# Altium project 1Rv2.PrjPCB (part 2 of 2)

## Sheet RF_ADF.SchDoc
size 320 x 228 mm; DocumentNumber: 5; SheetNumber: 5; SheetTotal: 5
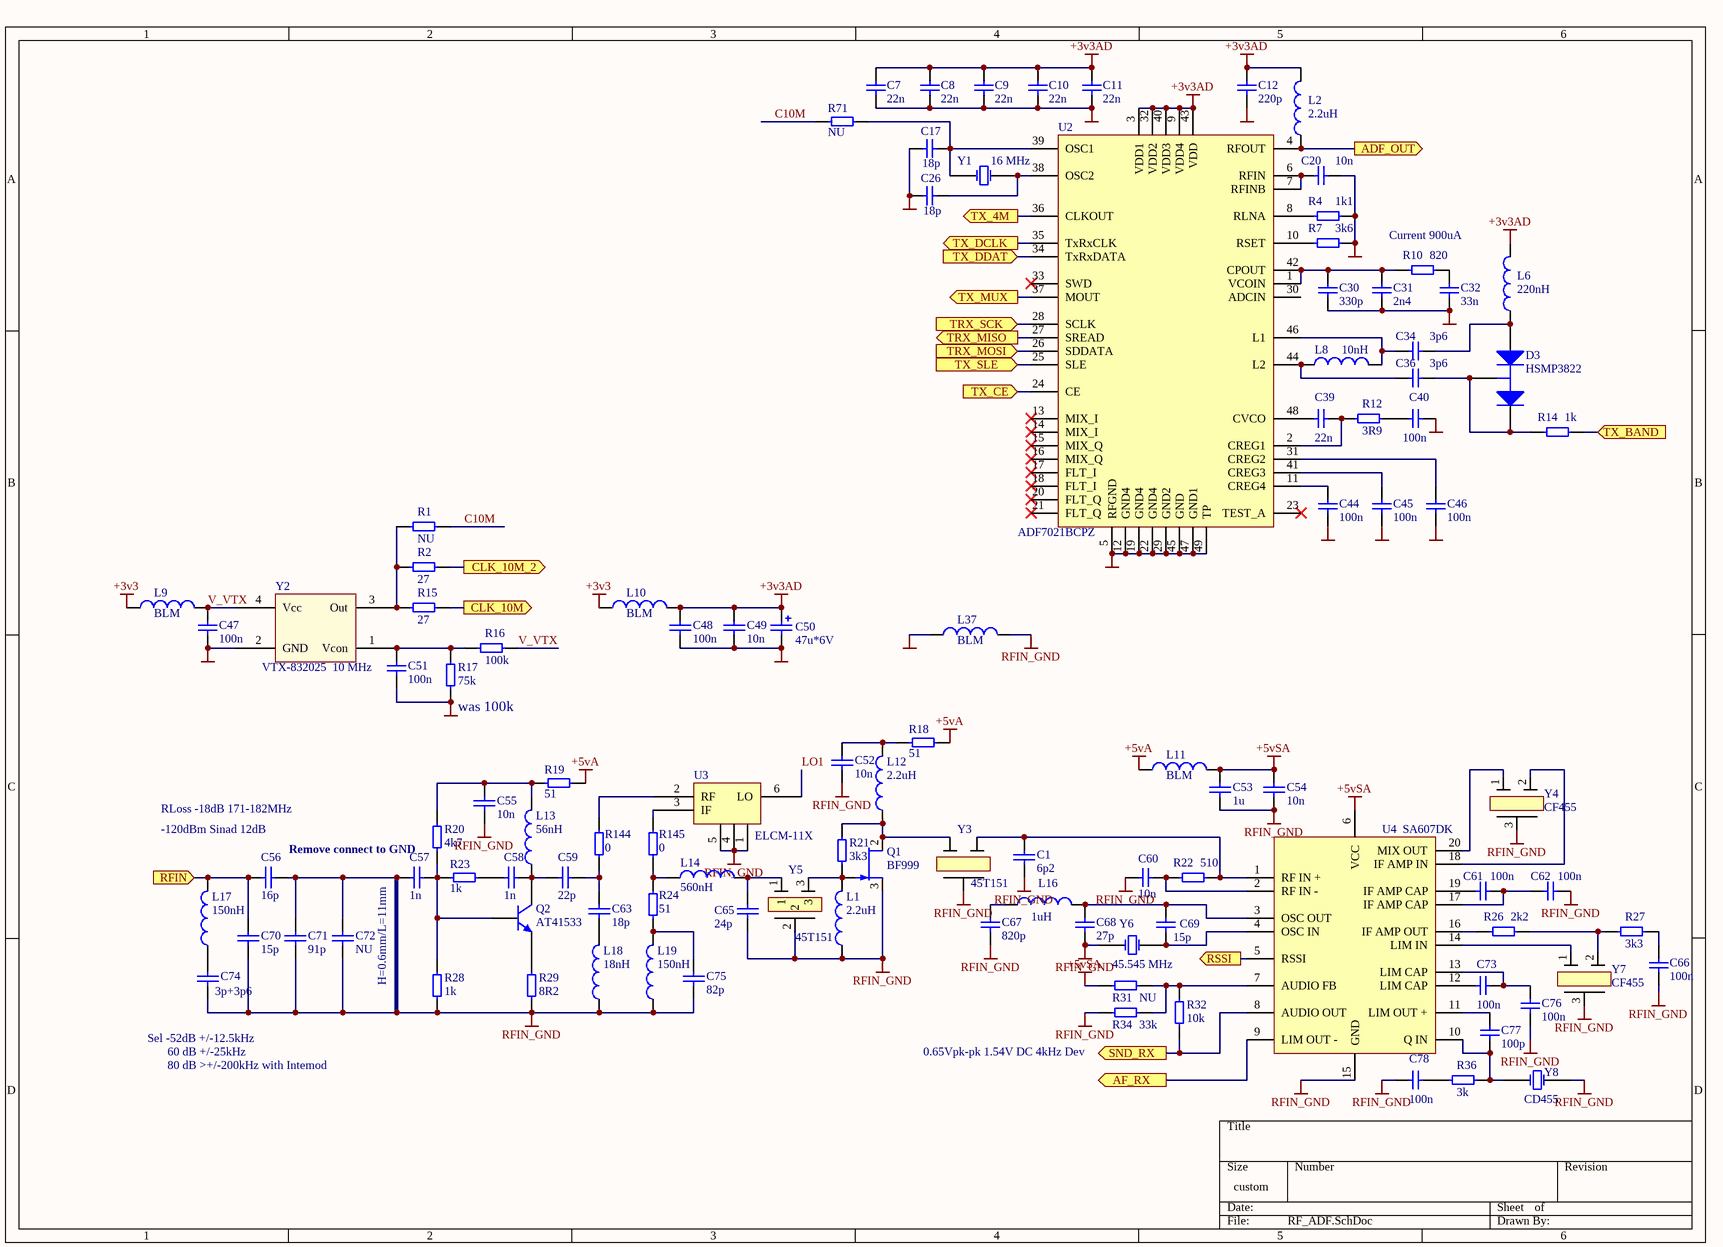
[diagram p4: RF_ADF.SchDoc]

### Parts
C1  6p2  [CAPC2012N]
C7  22n  [CAPC1608L]
C8  22n  [CAPC1608L]
C9  22n  [CAPC1608L]
C10  22n  [CAPC1608L]
C11  22n  [CAPC1608L]
C12  220p  [CAPC1608L]
C17  18p  [CAPC1608L]
C20  10n  [CAPC1608L]
C26  18p  [CAPC1608L]
C30  330p  [CAPC1608L]
C31  2n4  [CAPC1608L]
C32  33n  [CAPC1608L]
C34  3p6  [CAPC1608L]
C36  3p6  [CAPC1608L]
C39  22n  [CAPC1608L]
C40  100n  [CAPC1608L]
C44  100n  [CAPC1608L]
C45  100n  [CAPC1608L]
C46  100n  [CAPC1608L]
C47  100n  [CAPC1608L]
C48  100n  [CAPC1608N]
C49  10n  [CAPC1608N]
C50  47u*6V  [Case_A]
C51  100n  [CAPC1608L]
C52  10n  [CAPC2012N]
C53  1u  [CAPC2012L]
C54  10n  [CAPC1608L]
C55  10n  [CAPC2012N]
C56  16p  [CAPC2012N]
C57  1n  [CAPC2012N]
C58  1n  [CAPC2012N]
C59  22p  [CAPC2012N]
C60  10n  [CAPC1608L]
C61  100n  [CAPC1608L]
C62  100n  [CAPC1608L]
C63  18p  [CAPC2012N]
C65  24p  [CAPC2012N]
C66  100n  [CAPC1608L]
C67  820p  [CAPC1608L]
C68  27p  [CAPC1608L]
C69  15p  [CAPC1608L]
C70  15p  [CAPC2012N]
C71  91p  [CAPC2012N]
C72  NU  [CAPC2012N]
C73  100n  [CAPC1608L]
C74  3p+3p6  [CAPC2012N]
C75  82p  [CAPC2012N]
C76  100n  [CAPC1608L]
C77  100p  [CAPC1608L]
C78  100n  [CAPC1608L]
D3  HSMP3822  [SOT-23]
L1  2.2uH  [INDC2012N]
L2  2.2uH  [INDC2012L]
L6  220nH  [INDC2012L]
L8  10nH  [INDC2012L]
L9  BLM  [CAPC2012N]
L10  BLM  [CAPC2012N]
L11  BLM  [CAPC2012N]
L12  2.2uH  [INDC2012N]
L13  56nH  [INDC2012N]
L14  560nH  [INDC2012N]
L16  1uH  [INDC2012L]
L17  150nH  [INDC2012N]
L18  18nH  [INDC2012N]
L19  150nH  [INDC2012N]
L37  BLM  [CAPC2012N]
Q1  BF999  [sot23_n]
Q2  AT41533  [SOT-23]
R1  NU  [RESC1608L]
R2  27  [RESC1608L]
R4  1k1  [RESC1608L]
R7  3k6  [RESC1608L]
R10  820  [RESC1608L]
R12  3R9  [RESC1608L]
R14  1k  [RESC1608L]
R15  27  [RESC1608L]
R16  100k  [RESC1608L]
R17  75k  [RESC1608L]
R18  51  [RESC2012N]
R19  51  [RESC2012N]
R20  4k7  [RESC2012N]
R21  3k3  [RESC2012N]
R22  510  [RESC1608L]
R23  1k  [RESC2012N]
R24  51  [RESC2012N]
R26  2k2  [RESC1608L]
R27  3k3  [RESC1608L]
R28  1k  [RESC2012N]
R29  8R2  [RESC2012N]
R31  NU  [RESC1608L]
R32  10k  [RESC1608L]
R34  33k  [RESC1608L]
R36  3k  [RESC1608L]
R71  NU  [RESC1608L]
R144  0  [RESC1608L]
R145  0  [RESC1608L]
U2  ADF7021BCPZ  [QFN50P700X700X100-49N]
U3  ELCM-11X  [ELCM-11X]
U4  SA607DK  [SOT266-1]
Y1  16 MHz  [NX3225A]
Y2  VTX-832025  10 MHz  [SMD3.2x5]
Y3  45T151  [45T151AF]
Y4  CF455  [CFUCG455G]
Y5  45T151  [45T151AF]
Y6  45.545 MHz  [SIWARD UM-58]
Y7  CF455  [CFUCG455G]
Y8  CD455  [CDBC455CLX1]

### Ports
ADF_OUT (out), AF_RX (out), CLK_10M (out), CLK_10M_2 (out), RFIN (in), RSSI (out), SND_RX (out), TRX_MISO (out), TRX_MOSI (in), TRX_SCK (in), TX_4M (out), TX_BAND (in), TX_CE (in), TX_DCLK (out), TX_DDAT (in), TX_MUX (out), TX_SLE (in)

### Nets
+3v3: L9.1 L10.1
+3v3AD: C7.1 C8.1 C9.1 C10.1 C11.1 C12.1 C48.2 C49.2 C50.1 L2.2 L6.2 L10.2 U2.3(VDD1) U2.9(VDD4) U2.32(VDD2) U2.40(VDD3) U2.43(VDD)
+5vA: L11.1 R18.2 R19.2
+5vSA: C53.2 C54.2 L11.2 R31.2 U4.6(VCC)
GND: C7.2 C8.2 C9.2 C10.2 C11.2 C12.2 C17.1 C20.1 C26.2 C30.2 C31.2 C32.2 C40.1 C44.2 C45.2 C46.2 C47.2 C48.1 C49.1 C50.2 C51.2 L37.1 R4.1 R7.1 R17.2 U2.5(RFGND) U2.12(GND4) U2.19(GND4) U2.22(GND4) U2.29(GND2) U2.45(GND) U2.47(GND1) U2.49(TP) Y2.2(GND)
RFIN_GND: C1.1 C52.1 C53.1 C54.1 C55.1 C56.1 C57.2 C60.1 C62.2 C65.1 C66.2 C67.1 C68.1 C70.1 C71.1 C71.2 C72.1 C72.2 C74.1 C75.1 C76.1 C78.1 L1.1 L18.1 L19.1 L37.2 Q1.3(S) R28.2 R29.2 R34.1 U3.1(GND) U3.4(GND) U3.5(GND) U4.15(GND) Y3.2 Y4.3(GND) Y5.2 Y6.2(OSC2) Y7.3 Y8.2(OSC2)
ADF_OUT: L2.1 U2.4(RFOUT) ; port ADF_OUT
AF_RX: U4.9(LIM_OUT_-) ; port AF_RX
C10M: R1.1 R71.1
CLK_10M: R15.1 ; port CLK_10M
CLK_10M_2: R2.1 ; port CLK_10M_2
LO1: U3.6(LO)
RFIN: C56.2 C70.2 L17.2 ; port RFIN
RSSI: U4.5(RSSI) ; port RSSI
SND_RX: R32.2 U4.8(AUDIO_OUT) ; port SND_RX
TRX_MISO: U2.27(SREAD) ; port TRX_MISO
TRX_MOSI: U2.26(SDDATA) ; port TRX_MOSI
TRX_SCK: U2.28(SCLK) ; port TRX_SCK
TX_4M: U2.36(CLKOUT) ; port TX_4M
TX_BAND: R14.1 ; port TX_BAND
TX_CE: U2.24(CE) ; port TX_CE
TX_DCLK: U2.35(TxRxCLK) ; port TX_DCLK
TX_DDAT: U2.34(TxRxDATA) ; port TX_DDAT
TX_MUX: U2.37(MOUT) ; port TX_MUX
TX_SLE: U2.25(SLE) ; port TX_SLE
V_VTX: C47.1 L9.2 R16.1 Y2.4(Vcc)
NetC1_2: C1.2 R22.1 U4.1(RF_IN_+) Y3.3
NetC17_2: C17.2 R71.2 U2.39(OSC1) Y1.1(OSC1)
NetC20_2: C20.2 U2.6(RFIN) U2.7(RFINB)
NetC26_1: C26.1 U2.38(OSC2) Y1.2(OSC2)
NetC30_1: C30.1 C31.1 R10.2 U2.1(VCOIN) U2.42(CPOUT)
NetC32_1: C32.1 R10.1
NetC34_1: C34.1 D3.1(A) L6.1
NetC34_2: C34.2 L8.2 U2.46(L1)
NetC36_1: C36.1 D3.2(K) D3.3(C) R14.2
NetC36_2: C36.2 L8.1 U2.44(L2)
NetC39_1: C39.1 R12.2 U2.2(CREG1)
NetC39_2: C39.2 U2.48(CVCO)
NetC40_2: C40.2 R12.1
NetC44_1: C44.1 U2.11(CREG4)
NetC45_1: C45.1 U2.41(CREG3)
NetC46_1: C46.1 U2.31(CREG2)
NetC51_1: C51.1 R16.2 R17.1 Y2.1(Vcon)
NetC52_2: C52.2 L12.2 R18.1
NetC55_2: C55.2 L13.2 R19.1 R20.1
NetC57_1: C57.1 Q2.1(B) R20.2 R23.1 R28.1
NetC58_1: C58.1 C59.2 L13.1 Q2.3(C)
NetC58_2: C58.2 R23.2
NetC59_1: C59.1 C63.2 R144.2
NetC60_2: C60.2 R22.2 U4.2(RF_IN_-)
NetC61_1: C61.1 U4.19(IF_AMP_CAP)
NetC61_2: C61.2 C62.1 U4.17(IF_AMP_CAP)
NetC63_1: C63.1 L18.2
NetC65_2: C65.2 L14.2 Y5.1
NetC66_1: C66.1 R27.1
NetC67_2: C67.2 L16.1
NetC68_2: C68.2 C69.2 L16.2 U4.3(OSC_OUT)
NetC69_1: C69.1 U4.4(OSC_IN) Y6.1(OSC1)
NetC73_1: C73.1 U4.12(LIM_CAP)
NetC73_2: C73.2 C76.2 U4.13(LIM_CAP)
NetC74_2: C74.2 L17.1
NetC75_2: C75.2 L19.2 R24.2
NetC77_1: C77.1 R36.1 U4.10(Q_IN) Y8.1(OSC1)
NetC77_2: C77.2 U4.11(LIM_OUT_+)
NetC78_2: C78.2 R36.2
NetL1_2: L1.2 Q1.1(G) R21.2 Y5.3
NetL12_1: L12.1 Q1.2(D) R21.1 Y3.1
NetL14_1: L14.1 R24.1 R145.2
NetQ2_2: Q2.2(E) R29.1
NetR1_2: R1.2 R2.2 R15.2 Y2.3(Out)
NetR4_2: R4.2 U2.8(RLNA)
NetR7_2: R7.2 U2.10(RSET)
NetR26_1: R26.1 R27.2 Y7.2
NetR26_2: R26.2 U4.16(IF_AMP_OUT)
NetR31_1: R31.1 R32.1 R34.2 U4.7(AUDIO_FB)
NetR144_1: R144.1 U3.2(RF)
NetR145_1: R145.1 U3.3(IF)
NetU4_14: U4.14(LIM_IN) Y7.1
NetU4_18: U4.18(IF_AMP_IN) Y4.2(Out)
NetU4_20: U4.20(MIX_OUT) Y4.1(In)

Not connected (* = marked no-connect by the designer): U2 13(MIX_I)* 14(MIX_I)* 15(MIX_Q)* 16(MIX_Q)* 17(FLT_I)* 18(FLT_I)* 20(FLT_Q)* 21(FLT_Q)* 23(TEST_A)* 30(ADCIN) 33(SWD)*

### Notes on the sheet
- Current 900uA
- (near R17) was 100k
- -120dBm Sinad 12dB
- RLoss -18dB 171-182MHz
- Remove connect to GND
- H=0.6mm/L=11mm
- (near C74) Sel -52dB +/-12.5kHz
- 60 dB +/-25kHz
- (near R34) 0.65Vpk-pk 1.54V DC 4kHz Dev
- 80 dB >+/-200kHz with Intemod

### Library data of the parts
C1 C7-C12 C17 C20 C26 C30-C32 C34 C36 C39 C40 C44-C49 C51-C63 C65-C78 = Cap: Capacitor; Value: 100pF; Published: 8-Jun-2000; LatestRevisionDate: 17-Jul-2002; LatestRevisionNote: Re-released for DXP Platform.; PackageReference: RAD-0.3; Publisher: Altium Limited
C50 = Cap Pol: Polarized Capacitor (Surface Mount); Value: 100pF; Published: 8-Jun-2000; LatestRevisionDate: 17-Jul-2002; LatestRevisionNote: Re-released for DXP Platform.; PackageReference: C0805; Publisher: Altium Limited
D3 = SMBD7000: Silicon Switching Diode Array for High-Speed Switching; Type: Диод; Published: 21-Mar-2003; DatasheetDocument: Oct-1999; PackageDocument: Sep-2001; PackageReference: SOT-23; Publisher: Altium Limited; ComponentLink1Description: Manufacturer Link; ComponentLink1URL: http://www.infineon.com/
L1 L12-L14 L17-L19 = Inductor: Code_IEC: 1005; Value: 10mH; Published: 8-Jun-2000; LatestRevisionDate: 17-Jul-2002; LatestRevisionNote: Re-released for DXP Platform.; PackageReference: 0402-A; Publisher: Altium Limited; Code_JEITA: 0402
L2 L6 L8 L16 = INDUCTOR: Type: Индуктивность
L9-L11 L37 = Ferrite Bead: Code_IEC: 1005; Value: 10mH; Published: 8-Jun-2000; LatestRevisionDate: 17-Jul-2002; LatestRevisionNote: Re-released for DXP Platform.; PackageReference: 0402-A; Publisher: Altium Limited; Code_JEITA: 0402
Q1 = BF999: N-channel Silicon Junction Field-effect Transistor; Published: 17-Sep-2003; LatestRevisionDate: 12-Dec-2006; LatestRevisionNote: IPC-7351 Footprint Added.; DatasheetVersion: 29-Jul-1996; PackageVersion: May-1999; PackageReference: SOT23; Publisher: Altium Limited; PackageDescription: 3-Pin SOT-23 Package 0.95 mm Pitch, 2.3 mm Lead Span; ComponentLink1Description: Manufacturer Link; ComponentLink1URL: http://www.semiconductors.philips.com/; ComponentLink2Description: Datasheet; ComponentLink2URL: http://www.semiconductors.philips.com/acrobat/datasheets/BF545A_BF545B_BF545C_3.pdf
Q2 = BFR92A: NPN 5 GHz Wideband Transistor; Published: 17-Sep-2003; LatestRevisionDate: 12-Dec-2006; LatestRevisionNote: IPC-7351 Footprint Added.; DatasheetVersion: 29-Oct-1997; PackageVersion: May-1999; PackageReference: SOT23; Publisher: Altium Limited; PackageDescription: 3-Pin SOT-23 Package 0.95 mm Pitch, 2.3 mm Lead Span; ComponentLink1Description: Manufacturer Link; ComponentLink1URL: http://www.semiconductors.philips.com/; ComponentLink2Description: Datasheet; ComponentLink2URL: http://www.semiconductors.philips.com/acrobat/datasheets/BFR92A_2.pdf
R1 R2 R4 R7 R10 R12 R15-R22 R24 R26 R27 R29 R31 R32 R34 R36 R71 R144 R145 = Res: Resistor; Value: 1K; Published: 8-Jun-2000; LatestRevisionDate: 04-Mar-2005; LatestRevisionNote: PCB Footprint replaced.; PackageReference: J1-0603; Publisher: Altium Limited
R14 R23 R28 = Res: Resistor; Published: 8-Jun-2000; LatestRevisionDate: 04-Mar-2005; LatestRevisionNote: PCB Footprint replaced.; PackageReference: J1-0603; Publisher: Altium Limited; Value: 1K
U2 = ADF7021: ISM Band, FSK/ASK Tranceiver IC
U3 = ELCM-11X: Broadband mixer
U4 = SA607: Low-voltage high perfomance mixer FM IF system
Y1 Y6 = XTAL: Crystal Oscillator; Published: 8-Jun-2000; LatestRevisionDate: 17-Jul-2002; LatestRevisionNote: Re-released for DXP Platform.; PackageReference: R38; Publisher: Altium Limited
Y2 = KT18B-DCU28B
Y3 Y5 = SFE10.7MS3: 10.7 IF Filter
Y4 Y7 = SFE10.7MS3: 455k IF Filter
Y8 = XTAL: 455k Discriminator; Published: 8-Jun-2000; LatestRevisionDate: 17-Jul-2002; LatestRevisionNote: Re-released for DXP Platform.; PackageReference: R38; Publisher: Altium Limited

## Sheet RF_VCO.SchDoc
size A4
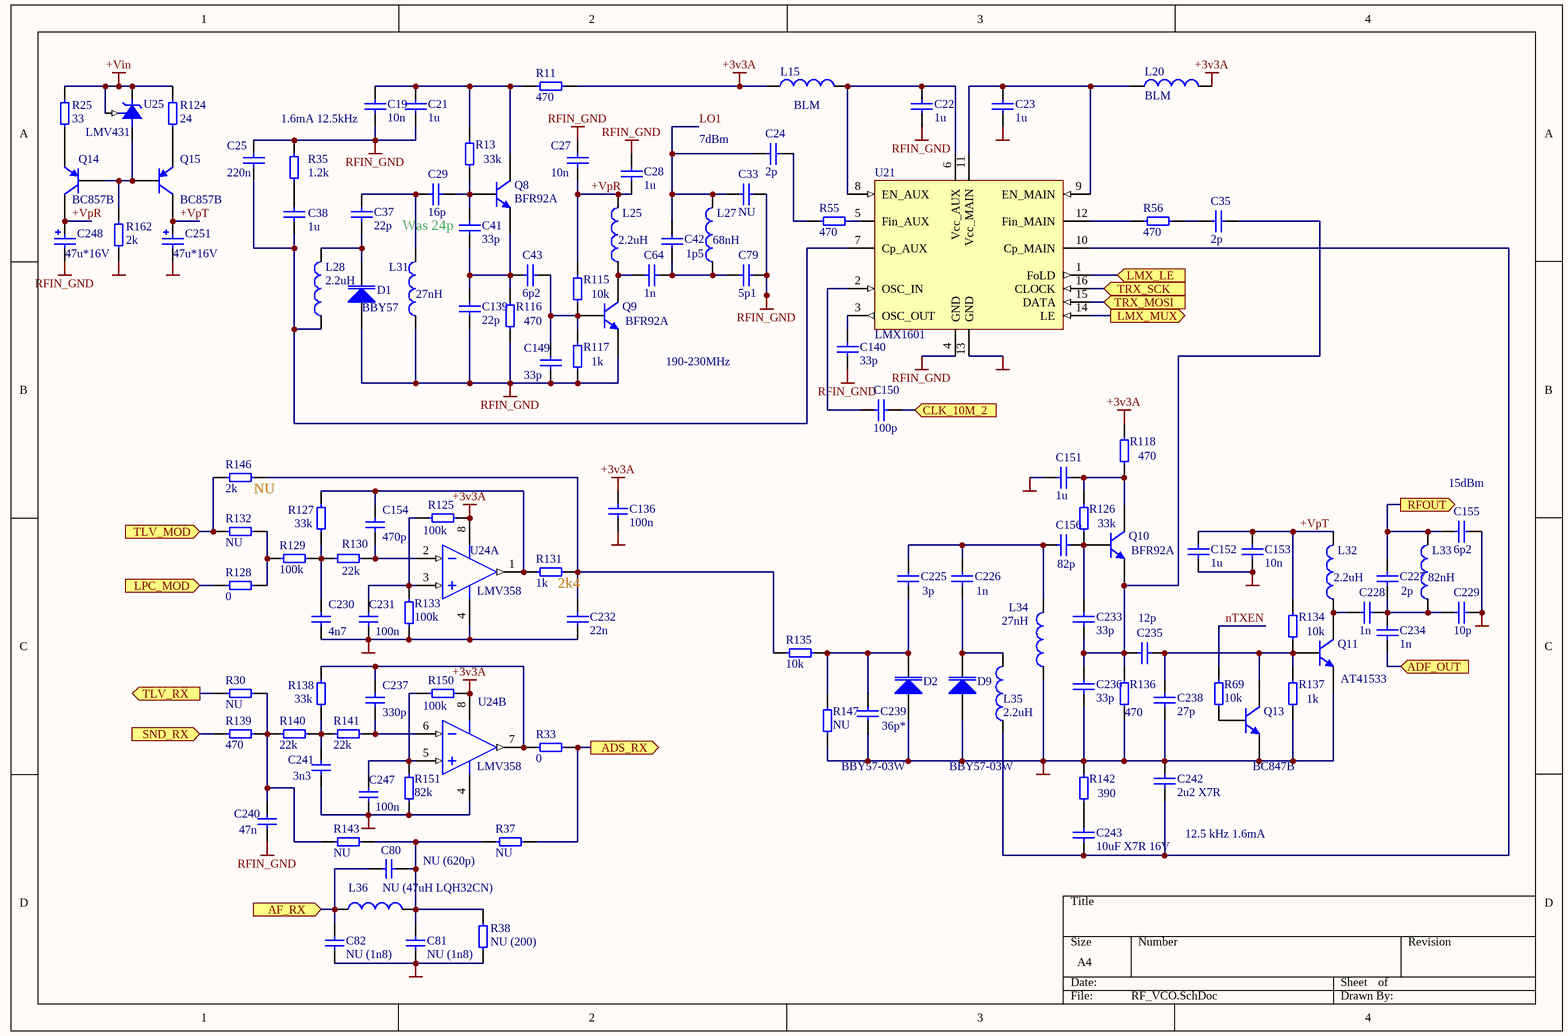
[diagram p5: RF_VCO.SchDoc]

### Parts
C19  10n  [CAPC1608L]
C21  1u  [CAPC2012L]
C22  1u  [CAPC2012L]
C23  1u  [CAPC2012L]
C24  2p  [CAPC1608L]
C25  220n  [CAPC1608L]
C27  10n  [CAPC1608L]
C28  1u  [CAPC2012L]
C29  16p  [CAPC1608L]
C33  NU  [CAPC1608L]
C35  2p  [CAPC1608L]
C37  22p  [CAPC1608L]
C38  1u  [CAPC2012L]
C41  33p  [CAPC1608L]
C42  1p5  [CAPC1608L]
C43  6p2  [CAPC1608L]
C64  1n  [CAPC1608L]
C79  5p1  [CAPC1608L]
C80  NU (620p)  [CAPC1608L]
C81  NU (1n8)  [CAPC1608L]
C82  NU (1n8)  [CAPC1608L]
C136  100n  [CAPC1608L]
C139  22p  [CAPC1608L]
C140  33p  [CAPC1608L]
C149  33p  [CAPC1608L]
C150  100p  [CAPC1608L]
C151  1u  [CAPC2012L]
C152  1u  [CAPC2012L]
C153  10n  [CAPC1608L]
C154  470p  [CAPC1608L]
C155  6p2  [CAPC1608L]
C156  82p  [CAPC1608L]
C225  3p  [CAPC1608L]
C226  1n  [CAPC1608L]
C227  2p  [CAPC1608L]
C228  1n  [CAPC1608L]
C229  10p  [CAPC1608L]
C230  4n7  [CAPC1608L]
C231  100n  [CAPC1608L]
C232  22n  [CAPC1608L]
C233  33p  [CAPC1608L]
C234  1n  [CAPC1608L]
C235  12p  [CAPC1608L]
C236  33p  [CAPC1608L]
C237  330p  [CAPC1608L]
C238  27p  [CAPC1608L]
C239  36p*  [CAPC1608L]
C240  47n  [CAPC1608L]
C241  3n3  [CAPC1608L]
C242  2u2 X7R  [CAPC2012L]
C243  10uF X7R 16V  [CAPC3216M]
C247  100n  [CAPC1608L]
C248  47u*16V  [Case_C]
C251  47u*16V  [Case_C]
D1  BBY57  [SOD-323]
D2  BBY57-03W  [SOD-323]
D9  BBY57-03W  [SOD-323]
L15  BLM  [CAPC2012N]
L20  BLM  [CAPC2012N]
L25  2.2uH  [INDC2012L]
L27  68nH  [INDC2012L]
L28  2.2uH  [INDC2012L]
L31  27nH  [INDC2012L]
L32  2.2uH  [INDC2012L]
L33  82nH  [INDC2012L]
L34  27nH  [INDC2012L]
L35  2.2uH  [INDC2012L]
L36  NU (47uH LQH32CN)  [CAPC3225N]
Q8  BFR92A  [SOT-23]
Q9  BFR92A  [SOT-23]
Q10  BFR92A  [SOT-23]
Q11  AT41533  [SOT-23]
Q13  BC847B  [SOT23_N]
Q14  BC857B  [SOT23_N]
Q15  BC857B  [SOT23_N]
R11  470  [RESC1608L]
R13  33k  [RESC1608L]
R25  33  [RESC1608L]
R30  NU  [RESC1608L]
R33  0  [RESC1608L]
R35  1.2k  [RESC1608L]
R37  NU  [RESC1608L]
R38  NU (200)  [RESC1608L]
R55  470  [RESC1608L]
R56  470  [RESC1608L]
R69  10k  [RESC1608L]
R115  10k  [RESC1608L]
R116  470  [RESC1608L]
R117  1k  [RESC1608L]
R118  470  [RESC1608L]
R124  24  [RESC1608L]
R125  100k  [RESC1608L]
R126  33k  [RESC1608L]
R127  33k  [RESC1608L]
R128  0  [RESC1608L]
R129  100k  [RESC1608L]
R130  22k  [RESC1608L]
R131  1k  [RESC1608L]
R132  NU  [RESC1608L]
R133  100k  [RESC1608L]
R134  10k  [RESC1608L]
R135  10k  [RESC1608L]
R136  470  [RESC1608L]
R137  1k  [RESC1608L]
R138  33k  [RESC1608L]
R139  470  [RESC1608L]
R140  22k  [RESC1608L]
R141  22k  [RESC1608L]
R142  390  [RESC1608L]
R143  NU  [RESC1608L]
R146  2k  [RESC1608L]
R147  NU  [RESC1608L]
R150  100k  [RESC1608L]
R151  82k  [RESC1608L]
R162  2k  [RESC1608L]
U21  LMX1601  [TSSOP65P640X120-16N]
U24  LMV358  [SOIC-150-8]  (parts A,B of 2)
U25  LMV431  [MF03A_N]

### Ports
ADF_OUT (in), ADS_RX (out), AF_RX (in), CLK_10M_2 (in), LMX_LE (in), LMX_MUX (out), LPC_MOD (in), RFOUT (out), SND_RX (in), TLV_MOD (in), TLV_RX (out), TRX_MOSI (in), TRX_SCK (in)

### Nets
+3v3A: C136.1 L15.2 L20.2 R11.2 R118.1 R125.2 R150.2 U24.8(V+)
+Vin: R25.2 R124.2 U25.1(REF) U25.2(K)
GND: C23.1 C81.1 C82.1 C136.2 C151.2 C152.1 C153.1 C155.2 C229.2 C230.2 C231.2 C232.2 C236.2 C238.2 C239.1 C241.2 C242.1 C247.2 C251.2 D2.2(A) D9.2(A) L34.1 Q11.2(E) Q13.2(E) R38.2 R133.2 R136.2 R137.2 R142.1 R147.1 R151.2 R162.1 U21.13(GND) U24.4(V-)
RFIN_GND: C19.1 C21.1 C22.1 C25.1 C27.1 C28.1 C33.2 C79.2 C139.2 C140.2 C149.2 C240.2 C248.2 D1.2(A) L31.1 Q9.2(E) R35.1 R116.2 R117.2 U21.4(GND)
+VpR: C27.2 C28.2 C248.1 L25.2 Q14.3(C) R115.1
+VpT: C152.2 C153.2 C251.1 L32.2 Q15.3(C) R134.1
ADF_OUT: C234.2 ; port ADF_OUT
ADS_RX: R33.2 R37.1 ; port ADS_RX
AF_RX: C80.2 C82.2 L36.1 ; port AF_RX
CLK_10M_2: C150.2 ; port CLK_10M_2
LMX_LE: U21.1(FoLD) ; port LMX_LE
LMX_MUX: U21.14(LE) ; port LMX_MUX
LO1: C24.1 C33.1 C42.2 L27.2
LPC_MOD: R128.1 ; port LPC_MOD
nTXEN: R69.1
RFOUT: C155.1 C227.2 L33.2 ; port RFOUT
SND_RX: R139.2 ; port SND_RX
TLV_MOD: R132.1 R146.1 ; port TLV_MOD
TLV_RX: R30.2 ; port TLV_RX
TRX_MOSI: U21.15(DATA) ; port TRX_MOSI
TRX_SCK: U21.16(CLOCK) ; port TRX_SCK
NetC19_2: C19.2 C21.2 Q8.3(C) R11.1 R13.1
NetC22_2: C22.2 L15.1 U21.6(Vcc_AUX) U21.8(EN_AUX)
NetC23_2: C23.2 L20.1 U21.9(EN_MAIN) U21.11(Vcc_MAIN)
NetC24_2: C24.2 R55.1
NetC25_2: C25.2 C38.2 L28.1 U21.7(Cp_AUX)
NetC29_1: C29.1 C41.1 Q8.1(B) R13.2
NetC29_2: C29.2 C37.2 L31.2
NetC35_1: C35.1 R56.2
NetC35_2: C35.2 C233.2 C235.1 C236.1 Q10.2(E) R136.1
NetC37_1: C37.1 D1.1(K) L28.2
NetC38_1: C38.1 R35.2
NetC41_2: C41.2 C43.2 C139.1 Q8.2(E) R116.1
NetC42_1: C42.1 C64.1 C79.1 L27.1
NetC43_1: C43.1 C149.1 Q9.1(B) R115.2 R117.1
NetC64_2: C64.2 L25.1 Q9.3(C)
NetC80_1: C80.1 C81.2 L36.2 R37.2 R38.1 R143.2
NetC140_1: C140.1 U21.3(OSC_OUT)
NetC150_1: C150.1 U21.2(OSC_IN)
NetC151_1: C151.1 Q10.3(C) R118.2 R126.1
NetC154_1: C154.1 R127.1 R131.1 U24.1(OUTA)
NetC154_2: C154.2 R130.2 U24.2(INA-)
NetC156_1: C156.1 C233.1 Q10.1(B) R126.2
NetC156_2: C156.2 C225.2 C226.2 L34.2
NetC225_1: C225.1 C239.2 D2.1(K) R135.2 R147.2
NetC226_1: C226.1 D9.1(K) L35.2
NetC227_1: C227.1 C228.1 C229.1 C234.1 L33.1
NetC228_2: C228.2 L32.1 Q11.3(C)
NetC230_1: C230.1 R127.2 R129.2 R130.1
NetC231_1: C231.1 R125.1 R133.1 U24.3(INA+)
NetC232_1: C232.1 R131.2 R135.1 R146.2
NetC235_2: C235.2 C238.1 Q11.1(B) Q13.3(C) R134.2 R137.1
NetC237_1: C237.1 R33.1 R138.1 U24.7(OUTB)
NetC237_2: C237.2 R141.1 U24.6(INB-)
NetC240_1: C240.1 R30.1 R139.1 R140.2 R143.1
NetC241_1: C241.1 R138.2 R140.1 R141.2
NetC242_2: C242.2 C243.1 L35.1 U21.10(Cp_MAIN)
NetC243_2: C243.2 R142.2
NetC247_1: C247.1 R150.1 R151.1 U24.5(INB+)
NetQ13_1: Q13.1(B) R69.2
NetQ14_1: Q14.1(B) Q15.1(B) R162.2 U25.3(A)
NetQ14_2: Q14.2(E) R25.1
NetQ15_2: Q15.2(E) R124.1
NetR55_2: R55.2 U21.5(Fin_AUX)
NetR56_1: R56.1 U21.12(Fin_MAIN)
NetR128_2: R128.2 R129.1 R132.2

### Notes on the sheet
- 1.6mA 12.5kHz
- 7dBm
- Was 24p
- 190-230MHz
- (near R146) NU
- 15dBm
- (near R131) 2k4
- (near C242) 12.5 kHz 1.6mA

### Library data of the parts
C19 C21-C25 C27-C29 C33 C35 C37 C38 C41-C43 C64 C79-C82 C136 C139 C140 C149-C156 C225-C243 C247 = Cap: Capacitor; Value: 100pF; Published: 8-Jun-2000; LatestRevisionDate: 17-Jul-2002; LatestRevisionNote: Re-released for DXP Platform.; PackageReference: RAD-0.3; Publisher: Altium Limited
C248 C251 = Cap Pol: as C50 on sheet RF_ADF; Published: 8-Jun-2000; LatestRevisionDate: 17-Jul-2002; LatestRevisionNote: Re-released for DXP Platform.; PackageReference: C0805; Publisher: Altium Limited
D1 D2 D9 = BBY57-03W: Silicon High Q Hyperabrupt Tuning Diode; Published: 21-Mar-2003; LatestRevisionDate: 19-Mar-2004; LatestRevisionNote: Silkscreen size reduced.; DatasheetDocument: Aug-1998; PackageDocument: Sep-2000; PackageReference: SOD-323; Publisher: Altium Limited; ComponentLink1Description: Manufacturer Link; ComponentLink1URL: http://www.infineon.com/
L15 L20 = Ferrite Bead: Code_IEC: 1005; Value: 10mH; Published: 8-Jun-2000; LatestRevisionDate: 17-Jul-2002; LatestRevisionNote: Re-released for DXP Platform.; PackageReference: 0402-A; Publisher: Altium Limited; Code_JEITA: 0402
L25 L27 L28 L31-L36 = INDUCTOR
Q8-Q11 = BFR92A: NPN 5 GHz Wideband Transistor; Published: 17-Sep-2003; LatestRevisionDate: 12-Dec-2006; LatestRevisionNote: IPC-7351 Footprint Added.; DatasheetVersion: 29-Oct-1997; PackageVersion: May-1999; PackageReference: SOT23; Publisher: Altium Limited; PackageDescription: 3-Pin SOT-23 Package 0.95 mm Pitch, 2.3 mm Lead Span; ComponentLink1Description: Manufacturer Link; ComponentLink1URL: http://www.semiconductors.philips.com/; ComponentLink2Description: Datasheet; ComponentLink2URL: http://www.semiconductors.philips.com/acrobat/datasheets/BFR92A_2.pdf
Q13 = BC847B: NPN General-purpose Transistor; Published: 17-Sep-2003; LatestRevisionDate: 12-Dec-2006; LatestRevisionNote: IPC-7351 Footprint Added.; DatasheetVersion: 4-Feb-2002; PackageVersion: May-1999; PackageReference: SOT23; Publisher: Altium Limited; PackageDescription: 3-Pin SOT-23 Package 0.95 mm Pitch, 2.3 mm Lead Span; ComponentLink1Description: Manufacturer Link; ComponentLink1URL: http://www.semiconductors.philips.com/; ComponentLink2Description: Datasheet; ComponentLink2URL: http://www.semiconductors.philips.com/acrobat/datasheets/BC846_BC847_BC848_5.pdf
Q14 Q15 = BC857B: PNP General-purpose Transistor; Published: 17-Sep-2003; LatestRevisionDate: 12-Dec-2006; LatestRevisionNote: IPC-7351 Footprint Added.; DatasheetVersion: 4-Feb-2002; PackageVersion: May-1999; PackageReference: SOT23; Publisher: Altium Limited; PackageDescription: 3-Pin SOT-23 Package 0.95 mm Pitch, 2.3 mm Lead Span; ComponentLink1Description: Manufacturer Link; ComponentLink1URL: http://www.semiconductors.philips.com/; ComponentLink2Description: Datasheet; ComponentLink2URL: http://www.semiconductors.philips.com/acrobat/datasheets/BC856_BC857_BC858_6.pdf
R11 R13 R25 R30 R33 R35 R37 R38 R55 R56 R69 R115 R116 R118 R124-R130 R132-R136 R138-R143 R146 R147 R150 R151 R162 = Res: Resistor; Value: 1K; Published: 8-Jun-2000; LatestRevisionDate: 04-Mar-2005; LatestRevisionNote: PCB Footprint replaced.; PackageReference: J1-0603; Publisher: Altium Limited
R117 R131 R137 = Res: Resistor; Published: 8-Jun-2000; LatestRevisionDate: 04-Mar-2005; LatestRevisionNote: PCB Footprint replaced.; PackageReference: J1-0603; Publisher: Altium Limited; Value: 1K
U21 = LMX1601: Synthesizer
U24 = LMV358M: General Purpose, Low Voltage, Rail-to-Rail Output Operational Amplifiers; Manufacturer: National Semiconductor; PackageTopMarking: NSZXTT*LMV*358M; PowerWise: N; Published: 4-Dec-2008; LatestRevisionDate: 13-Jan-2009; LatestRevisionNote: Sim Model Added.; DatasheetVersion: Oct-2007; PackageVersion: revL, Sep-2006; PackageReference: M08A; Publisher: Altium Limited; PackageDescription: SOIC Narrow, 4.9 x 3.9 x 1.45mm, 8 Lead, 1.27mm Pitch; CompType: Amplifiers; PartNumber: LMV358M; RoHS: O; PinCount: 8; DigiKeyPartNumber: LMV358MMCT-ND; Code_JEDEC: MS-012-AA; Code_IPC: SOIC127P600-8; ComponentLink1Description: LMV358 Datasheet; ComponentLink1URL: http://www.national.com/ds/LM/LMV358.pdf; ComponentLink2Description: LMV358 Web Page; ComponentLink2URL: http://www.national.com/pf/LM/LMV358.html; ComponentLink3Description: M08A Package Page; ComponentLink3URL: http://www.national.com/packaging/folders/m08a.html
U25 = LMV431AIMF: Low-Voltage (1.24V) Adjustable Precision Shunt Regulator; Manufacturer: National Semiconductor; CompType: MiscPower; PackageTopMarking: RLA*XTT; PowerWise: N; FirstPublished: 4-Dec-2008; DatasheetVersion: May-2005; PackageVersion: revB, Mar-2003; PackageReference: MF03A; Publisher: Altium Limited; PackageDescription: Molded SOT-23, .115 x .051 x .037in Body, 3 Lead, .075 in Pitch; PartNumber: LMV431AIMF; RoHS: Y; PinCount: 3; DigiKeyPartNumber: LMV431AIMF-ND; ComponentLink1Description: LMV431 Datasheet; ComponentLink1URL: http://www.national.com/ds/LM/LMV431.pdf; ComponentLink2Description: LMV431A Web Page; ComponentLink2URL: http://www.national.com/pf/LM/LMV431A.html; ComponentLink3Description: MF03A Package Page; ComponentLink3URL: http://www.national.com/packaging/folders/mf03a.html

## Nets that join several sheets
+1v8: AT91 (R39.2 R42.2), INTERFACE (C111.2 U13.32), PWR (26 pins)
+3v3: AT91 (25 pins), INTERFACE (12 pins), LPC (23 pins), PWR (73 pins), RF_ADF (L9.1 L10.1)
+3v3A: PWR (C15.1 C16.1 U20.5), RF_VCO (8 pins)
+5vA: INTERFACE (L21.2 R70.1), PWR (5 pins), RF_ADF (L11.1 R18.2 R19.2)
+5vD: LPC (C113.1 C117.1 U15.3 U16.3), PWR (12 pins)
+Vin: INTERFACE (6 pins), PWR (C164.1 C244.2 L38.1 U22.8), RF_VCO (R25.2 R124.2 U25.1 U25.2)
GND: AT91 (33 pins), INTERFACE (63 pins), LPC (46 pins), PWR (130 pins), RF_ADF (34 pins), RF_VCO (34 pins)
RFIN_GND: INTERFACE (5 pins), PWR (C15.2 C16.2 C18.1 U20.2), RF_ADF (40 pins), RF_VCO (20 pins)
ADF_OUT: RF_ADF (L2.1 U2.4), RF_VCO (C234.2)
ADS_RX: LPC (R149.2 U18.3), RF_VCO (R33.2 R37.1)
AF_RX: RF_ADF (U4.9), RF_VCO (C80.2 C82.2 L36.1)
CAN_H1: INTERFACE (P5.a10), LPC (C114.2 R85.1 U15.7)
CAN_H2: INTERFACE (P5.a11), LPC (C118.2 R88.1 U16.7)
CAN_L1: INTERFACE (P5.c9), LPC (C115.2 R86.1 U15.6)
CAN_L2: INTERFACE (P5.c10), LPC (C119.2 R89.1 U16.6)
CLK_10M: LPC (C134.2), RF_ADF (R15.1)
CLK_10M_2: RF_ADF (R2.1), RF_VCO (C150.2)
CLK_18M: AT91 (R48.2), INTERFACE (U13.1)
CLK_50M: AT91 (C89.2 U5.202), LPC (R102.2)
DISIPTT: AT91 (U5.19), INTERFACE (Q4.1 R76.1 R77.2)
EINT: AT91 (U5.184), LPC (U17.21)
EMDC: AT91 (U5.205), LPC (U17.12)
EMDIO: AT91 (U5.206), LPC (R101.1 U17.11)
ERX0: AT91 (U5.195), LPC (R92.1 U17.16)
ERX1: AT91 (U5.196), LPC (R97.1 U17.15)
ERXDV: AT91 (U5.198), LPC (R91.1 U17.18)
ERXER: AT91 (U5.201), LPC (R99.1 U17.20)
ETX0: AT91 (U5.193), LPC (U17.24)
ETX1: AT91 (U5.194), LPC (U17.25)
ETXEN: AT91 (U5.197), LPC (U17.23)
F_AN0: INTERFACE (C92.2 R64.2), LPC (U14.21)
F_AN1: INTERFACE (C93.2 R65.2), LPC (U14.20)
LED_1A: AT91 (U5.190), INTERFACE (R66.2)
LED_1B: AT91 (U5.189), INTERFACE (R67.2)
LED_2A: AT91 (U5.186), INTERFACE (R72.2)
LED_2B: AT91 (U5.185), INTERFACE (R75.2)
LED_3A: AT91 (U5.192), INTERFACE (R78.2)
LED_3B: AT91 (U5.191), INTERFACE (R81.2)
LMX_LE: LPC (U14.51), RF_VCO (U21.1)
LMX_MUX: LPC (U14.26), RF_VCO (U21.14)
LO1: RF_ADF (U3.6), RF_VCO (C24.1 C33.1 C42.2 L27.2)
LPC_MOD: LPC (U14.6 U14.7), RF_VCO (R128.1)
LPC_nPTT: AT91 (U5.18), INTERFACE (D6.3 R74.1), LPC (U14.50)
LPC_SQ: AT91 (U5.17), INTERFACE (R83.1), LPC (U14.48)
nRES: AT91 (5 pins), LPC (P8.10 P9.6 U14.17 U17.32), PWR (R159.1)
nTXEN: LPC (U14.56), RF_VCO (R69.1)
RFIN: INTERFACE (P5.b31), RF_ADF (C56.2 C70.2 L17.2)
RFOUT: INTERFACE (P5.b2), RF_VCO (C155.1 C227.2 L33.2)
RSSI: LPC (R148.1), RF_ADF (U4.5)
SAM_RXD: AT91 (U5.21), INTERFACE (P6.1 U12.12)
SAM_TXD: AT91 (U5.22), INTERFACE (P6.2 U12.11)
SAM_VREF: AT91 (U5.157), PWR (C137.2 C138.2 L24.2 U5.160)
SCL: AT91 (R51.1 U5.1 U7.6), INTERFACE (U13.8)
SDA: AT91 (R50.1 U5.208 U7.5), INTERFACE (U13.9)
SND_RX: RF_ADF (R32.2 U4.8), RF_VCO (R139.2)
TLV_CLK: AT91 (U5.23), INTERFACE (U13.2)
TLV_DI: AT91 (U5.27), INTERFACE (U13.4)
TLV_DO: AT91 (U5.28), INTERFACE (U13.5)
TLV_FS: AT91 (U5.26), INTERFACE (U13.3)
TLV_MOD: INTERFACE (U13.27), RF_VCO (R132.1 R146.1)
TLV_nRES: AT91 (U5.158), INTERFACE (U13.31)
TLV_RX: INTERFACE (C99.1), RF_VCO (R30.2)
TRX_MISO: LPC (U14.59), RF_ADF (U2.27)
TRX_MOSI: LPC (U14.58), RF_ADF (U2.26), RF_VCO (U21.15)
TRX_SCK: LPC (U14.60), RF_ADF (U2.28), RF_VCO (U21.16)
TX_4M: LPC (U14.43), RF_ADF (U2.36)
TX_BAND: LPC (U14.65), RF_ADF (R14.1)
TX_CE: LPC (U14.67), RF_ADF (U2.24)
TX_DCLK: LPC (U14.52 U14.62), RF_ADF (U2.35)
TX_DDAT: LPC (U14.61), RF_ADF (U2.34)
TX_MUX: LPC (U14.69), RF_ADF (U2.37)
TX_SLE: LPC (U14.68), RF_ADF (U2.25)
UCS: AT91 (U5.12), LPC (U14.79)
UCTS: AT91 (U5.172), LPC (U14.66)
UINT: AT91 (U5.127), LPC (U14.70)
UMISO: AT91 (U5.9), LPC (U14.77)
UMOSI: AT91 (U5.10), LPC (U14.76)
URTS: AT91 (U5.171), LPC (U14.73)
URX0: AT91 (U5.16), LPC (U14.75)
USCK: AT91 (U5.11), LPC (U14.78)
UTX0: AT91 (U5.15), LPC (U14.74)
WDI_CNT: AT91 (U5.162), PWR (R122.2 R161.2)
WDI_EXT: AT91 (R3.2 R53.2), PWR (U23.4)

## Assembly variants
Diag: not fitted C72 C80 C81 C82 C85 C86 C89 C91 C99 C100 C101 C102 C103 C104 C105 C106 C107 C108 C109 C110 C111 C112 C113 C114 C115 C116 C117 C118 C119 C120 C126 C151 C152 C153 C154 C156 C221 C225 C226 C228 C230 C231 C232 C233 C235 C236 C238 C239 C242 C243 C250 C251 D2 D6 D8 D9 D10 L21 L22 L32 L34 L35 L36 P1 P2 P3 P6 P7 P9 Q3 Q4 Q5 Q10 Q11 Q13 Q15 R1 R30 R31 R37 R38 R39 R46 R53 R54 R57 R59 R60 R63 R68 R69 R70 R71 R73 R74 R76 R77 R79 R80 R82 R83 R84 R85 R86 R88 R89 R91 R92 R97 R99 R104 R105 R108 R110 R111 R118 R120 R124 R125 R126 R128 R129 R131 R132 R134 R135 R136 R137 R142 R143 R146 R147 R149 R152 R157 U7 U13 U15 U16 Y10
Voice: not fitted C7 C8 C9 C10 C11 C12 C17 C20 C26 C30 C31 C32 C34 C36 C39 C40 C44 C45 C46 C72 C80 C81 C82 C85 C86 C89 C91 C113 C114 C115 C116 C117 C118 C119 C120 C126 C154 C221 C230 C232 C234 C237 C241 C247 C250 D3 L2 L6 L8 L36 P1 P2 P3 P6 P7 P9 R1 R4 R7 R10 R12 R14 R31 R33 R37 R38 R39 R46 R53 R54 R57 R59 R60 R63 R71 R85 R86 R88 R89 R91 R92 R97 R99 R104 R105 R108 R110 R111 R120 R128 R129 R132 R140 R143 R149 R157 U2 U7 U15 U16 U18 Y1 Y10